# Altium schematic sheet Peripherals.SchDoc: Peripherals
size A4; Date: 01-DEC-2013; CompanyName: STMicroelectronics; Organization: Microcontrollers Division; Address1: 12, Rue Jules HOROWITZ; Address2: 38019 Grenoble; Address3: FRANCE; DocumentNumber: MB1272; Revision: A-01; SheetNumber: 17; SheetTotal: 18; Project: STM32MP15-DISCO PI
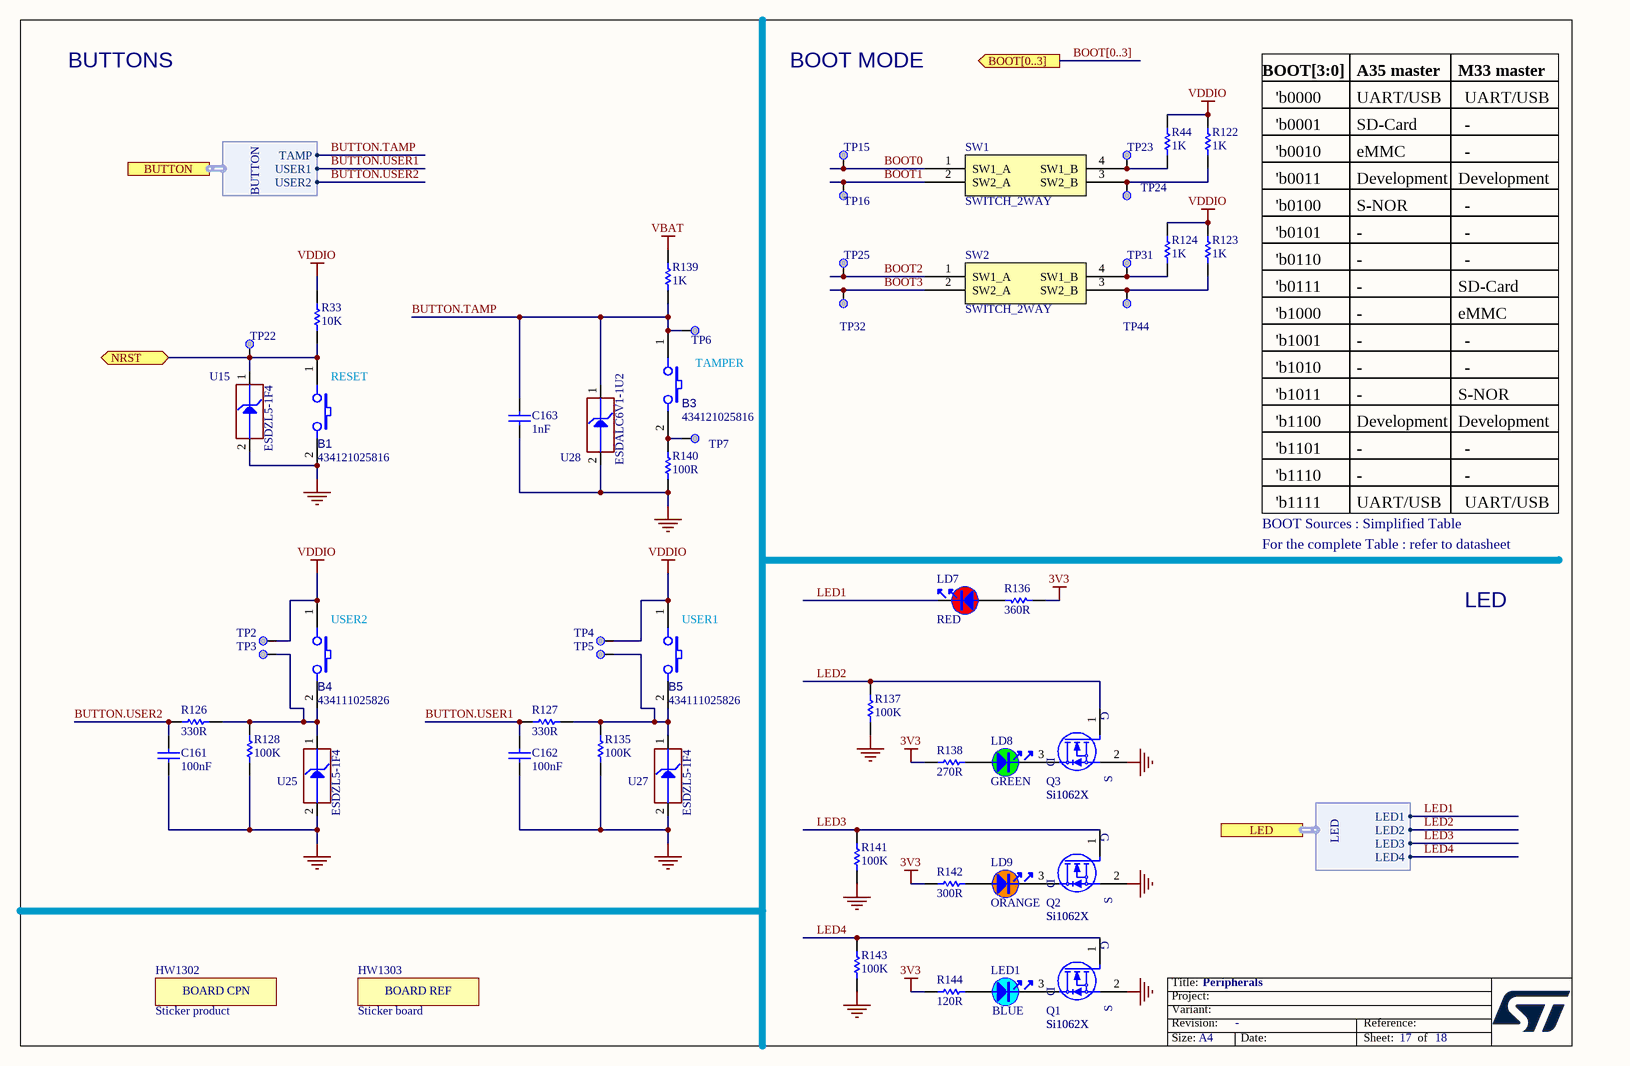
[diagram p0: Peripherals.SchDoc]

## Parts
B1  value 434121025816  [SWI_WE_434121025816]  (hidden comment: SW_PUSH_SMD_2P)
B3  value 434121025816  [SWI_WE_434121025816]  (hidden comment: SW_PUSH_SMD_2P)
B4  value 434111025826  [SWI_WE_4341x10258x6]  (hidden comment: SW_PUSH_SMD_2P)
B5  value 434111025826  [SWI_WE_4341x10258x6]  (hidden comment: SW_PUSH_SMD_2P)
C161  value 100nF  [C0402]  (hidden comment: Capacitor)
C162  value 100nF  [C0402]  (hidden comment: Capacitor)
C163  value 1nF  [C0402]  (hidden comment: Capacitor)
HW1302  value Sticker product  [STICKER_BOARD-CPN_25X5]  (hidden comment: ​PCH W35 footprint requested to have a space on board for stickers.)  (mechanical)
HW1303  value Sticker board  [STICKER_BOARD-REF_25X5]  (hidden comment: STICKER_BOARD_REF)  (mechanical)
LD7  value RED  [LED_0603_VISHAY_VLMS1300-GS08_RED_1A2K_H0P8]  (hidden comment: LED_red)
LD8  value GREEN  [LED_0603_OSRAM_LG-Q396-PS-35_GREEN_1A2K_H0P4]  (hidden comment: LED_green)
LD9  value ORANGE  [LED_0603_OSRAM_LO-Q976-PS-25_ORANGE_1A2K_H0P8]  (hidden comment: LED_orange)
LED1  value BLUE  [LED_0603_OSRAM_LB-Q39G-L2OO-35-1_BLUE_1A2K_H0P4]
Q1  value Si1062X  Manufacturer_Part_Number: Si1062X  [MOS_SC89-3L]  (hidden comment: MOSFET_N-CHANNEL)
Q2  value Si1062X  Manufacturer_Part_Number: Si1062X  [MOS_SC89-3L]  (hidden comment: MOSFET_N-CHANNEL)
Q3  value Si1062X  Manufacturer_Part_Number: Si1062X  [MOS_SC89-3L]  (hidden comment: MOSFET_N-CHANNEL)
R33  value 10K  [R0402]  (hidden comment: Resistor)
R44  value 1K  [R0402]  (hidden comment: Resistor)
R122  value 1K  [R0402]  (hidden comment: Resistor)
R123  value 1K  [R0402]  (hidden comment: Resistor)
R124  value 1K  [R0402]  (hidden comment: Resistor)
R126  value 330R  [R0402]  (hidden comment: Resistor)
R127  value 330R  [R0402]  (hidden comment: Resistor)
R128  value 100K  [R0402]  (hidden comment: Resistor)
R135  value 100K  [R0402]  (hidden comment: Resistor)
R136  value 360R  [R0402]  (hidden comment: Resistor)
R137  value 100K  [R0402]  (hidden comment: Resistor)
R138  value 270R  [R0402]  (hidden comment: Resistor)
R139  value 1K  [R0402]  (hidden comment: Resistor)
R140  value 100R  [R0402]  (hidden comment: Resistor)
R141  value 100K  [R0402]  (hidden comment: Resistor)
R142  value 300R  [R0402]  (hidden comment: Resistor)
R143  value 100K  [R0402]  (hidden comment: Resistor)
R144  value 120R  [R0402]
SW1  SWITCH_2WAY  [SWI_C&K_SDA02H1SBD_2POS]
SW2  SWITCH_2WAY  [SWI_C&K_SDA02H1SBD_2POS]
TP2  Test Point  [TP_SMD_1MM]  (value not drawn)  (no BOM)
TP3  Test Point  [TP_SMD_1MM]  (value not drawn)  (no BOM)
TP4  Test Point  [TP_SMD_1MM]  (value not drawn)  (no BOM)
TP5  Test Point  [TP_SMD_1MM]  (value not drawn)  (no BOM)
TP6  Test Point  [TP_SMD_1MM]  (value not drawn)  (no BOM)
TP7  Test Point  [TP_SMD_1MM]  (value not drawn)  (no BOM)
TP15  Test Point  [TP_SMD_1MM]  (value not drawn)  (no BOM)
TP16  Test Point  [TP_SMD_1MM]  (value not drawn)  (no BOM)
TP22  Test Point  [TP_SMD_1MM]  (value not drawn)  (no BOM)
TP23  Test Point  [TP_SMD_1MM]  (value not drawn)  (no BOM)
TP24  Test Point  [TP_SMD_1MM]  (value not drawn)  (no BOM)
TP25  Test Point  [TP_SMD_1MM]  (value not drawn)  (no BOM)
TP31  Test Point  [TP_SMD_1MM]  (value not drawn)  (no BOM)
TP32  Test Point  [TP_SMD_1MM]  (value not drawn)  (no BOM)
TP44  Test Point  [TP_SMD_1MM]  (value not drawn)  (no BOM)
U15  value ESDZL5-1F4  [ESD_ST0201]  (hidden comment: ESD-TRANSIL)
U25  value ESDZL5-1F4  [ESD_ST0201]  (hidden comment: ESD-TRANSIL)
U27  value ESDZL5-1F4  [ESD_ST0201]  (hidden comment: ESD-TRANSIL)
U28  value ESDALC6V1-1U2  [ESD_ST0201]  (hidden comment: ESD-TRANSIL)

## Ports
BOOT[0..3] (out), BUTTON (harness BUTTON), LED (harness LED), NRST (bidir)

## Harnesses
BUTTON: TAMP, USER1, USER2
LED: LED1, LED2, LED3, LED4

## Nets
3V3: R136.1 R138.2 R142.2 R144.1
GND: B1.2 C161.1 C162.1 C163.1 Q1.2(S) Q2.2(S) Q3.2(S) R128.1 R135.1 R137.1 R140.2 R141.1 R143.1 U15.2(GND) U25.2(GND) U27.2(GND) U28.2(GND)
VBAT: R139.2
VDDIO: B4.1 B5.1 R33.2 R44.2 R122.2 R123.2 R124.2 TP2.1 TP4.1
BOOT0: SW1.1(SW1_A) TP15.1
BOOT1: SW1.2(SW2_A) TP16.1
BOOT2: SW2.1(SW1_A) TP25.1
BOOT3: SW2.2(SW2_A) TP32.1
BUTTON.TAMP: B3.1 C163.2 R139.1 TP6.1 U28.1(IO1) ; port BUTTON.TAMP
BUTTON.USER1: C162.2 R127.1 ; port BUTTON.USER1
BUTTON.USER2: C161.2 R126.1 ; port BUTTON.USER2
LED1: LD7.2 ; port LED.LED1
LED2: Q3.1(G) R137.2 ; port LED.LED2
LED3: Q2.1(G) R141.2 ; port LED.LED3
LED4: Q1.1(G) R143.2 ; port LED.LED4
NRST: B1.1 R33.1 TP22.1 U15.1(IO1) ; port NRST
NetB3_2: B3.2 R140.1 TP7.1
NetB4_2: B4.2 R126.2 R128.2 TP3.1 U25.1(IO1)
NetB5_2: B5.2 R127.2 R135.2 TP5.1 U27.1(IO1)
NetLD7_1: LD7.1 R136.2
NetLD8_1: LD8.1 R138.1
NetLD8_2: LD8.2 Q3.3(D)
NetLD9_1: LD9.1 R142.1
NetLD9_2: LD9.2 Q2.3(D)
NetLED1_1: LED1.1 R144.2
NetLED1_2: LED1.2 Q1.3(D)
NetR44_1: R44.1 SW1.4(SW1_B) TP23.1
NetR122_1: R122.1 SW1.3(SW2_B) TP24.1
NetR123_1: R123.1 SW2.3(SW2_B) TP44.1
NetR124_1: R124.1 SW2.4(SW1_B) TP31.1

## Buses and harness runs
bus BOOT[0..3] = port BOOT[0..3]

## Notes on the sheet
- BUTTONS
- BOOT MODE
- BOOT[3:0]
- 'b0001
- 'b0000
- A35 master
- UART/USB
- SD-Card
- M33 master
- -
- 'b0010
- 'b0011
- eMMC
- Development
- 'b0100
- 'b0101
- 'b0110
- S-NOR
- 'b0111
- 'b1000
- (near B1) RESET
- TAMPER
- 'b1001
- 'b1010
- 'b1011
- 'b1100
- 'b1101
- BOOT Sources : Simplified Table
- 'b1110
- 'b1111
- For the complete Table : refer to datasheet
- (near B4) USER2
- (near B5) USER1
- LED
- Title:
- Project:
- Size:
- Revision:
- Variant:
- A4
- Date:
- Reference:
- Sheet:
- of
- (in symbol MCD-00235) BOARD REF
- (in symbol MCD-00547) BOARD CPN

## Library data of the parts
B1 B3 = MCD-03492: Switch tactile, SPST-NO, 50mA, 12V, 6x3.8mm; Part_Type: Misc; Part_Preference: Recommended; Manufacturer: WURTH ELEKTRONIC; ShowFields: YES; ID: 5608; Component_Country_Of_Origin: China°; Internal_Part_Number: MCD-03492; Status: Checked; Manufacturer_Part_Number: 434121025816; ComponentLink1URL: http://tunmcdsvn.tun.st.com/Component_Documentation_Library/Trunk/Misc/WURTH_ELECTRONIK_434121025816; Order_Code_Digikey: 732-7045-2-ND; Order_Code_Farnell: 1867991; Order_Code_RS: N/A; Package: 6x3.8mm
B4 B5 = MCD-03491: Switch tactile, SPST-NO, 50mA, 12V, 6x3.8mm; Part_Type: Misc; Part_Preference: Recommended; Manufacturer: WURTH ELEKTRONIC; ShowFields: YES; ID: 5607; Component_Country_Of_Origin: China°; Internal_Part_Number: MCD-03491; Status: Checked; Manufacturer_Part_Number: 434111025826; ComponentLink1URL: http://tunmcdsvn.tun.st.com/Component_Documentation_Library/Trunk/Misc/WURTH_ELECTRONIK_434111025826; Order_Code_Digikey: 732-7039-2-ND; Order_Code_Farnell: 1867992; Order_Code_RS: N/A; Package: 6x3.8mm
C161 C162 = MCD-00006: Capacitor, MLCC, 100nF, 16V, X7R, +/-10%, 0402, T=0.5mm; Manufacturer_Part_Number: CC0402KRX7R7BB104; Manufacturer: YAGEO; Part_Preference: Recommended; Alternate_Manufacturer: MURATA; Alternate_Manufacturer_Part_Number: GCM155R71C104KA55D; Partial_Alternate_Internal_Part_Number: MCD-03299; Order_Code_RS: 616-9701; Component_Country_Of_Origin: China; ID: 2474; ShowFields: YES; Alternate_EMS: M; Internal_Part_Number: MCD-00006; Status: Released; Part_Type: Capacitor; Package: 0402; ComponentLink1Description: Datasheet; ComponentLink1URL: http://tunmcdsvn.tun.st.com/Component_Documentation_Library/Trunk/Capacitor/YAGEO_X7R_Series; Order_Code_Digikey: 311-1338-1-ND; Order_Code_Farnell: 9402047
C163 = MCD-00198: Capacitor, MLCC, 1nF, 16V, X7R, +/-10%, 0402, T=0.5mm; Part_Preference: Recommended; Manufacturer: YAGEO; Manufacturer_Part_Number: CC0402KRX7R7BB102; Component_Country_Of_Origin: China; ShowFields: YES; ID: 2665; Internal_Part_Number: MCD-00198; Status: Released; Part_Type: Capacitor; Package: 0402; ComponentLink1URL: http://tunmcdsvn.tun.st.com/Component_Documentation_Library/Trunk/Capacitor/YAGEO_X7R_Series; Order_Code_Digikey: 311-1352-1-ND; Order_Code_Farnell: 2370642; Order_Code_RS: N/A
HW1302 = MCD-00547: Sticker to mention board CPN code; Part_Type: Misc; Part_Preference: Recommended; Provided_By: SUBCO; Initial_Board_Reference: MB1319; ID: 3197; ShowFields: YES; Internal_Part_Number: MCD-00547; Status: Released; Manufacturer_Part_Number: n/a; Manufacturer: n/a; ComponentLink1Description: Datasheet; ComponentLink1URL: N/A; ECCN_US: n/a; ECCN_EU: n/a; Order_Code_Digikey: N/A; Order_Code_Farnell: N/A; Order_Code_RS: N/A
HW1303 = MCD-00235: Sticker to mention board reference + serial number; Part_Type: Misc; Part_Preference: Recommended; Provided_By: SUBCO; Initial_Board_Reference: MB1319; ID: 2632; ShowFields: YES; Internal_Part_Number: MCD-00235; Status: Released; Manufacturer_Part_Number: n/a; Manufacturer: n/a; ComponentLink1Description: Datasheet; ComponentLink1URL: n/a; ECCN_US: n/a; ECCN_EU: n/a; Order_Code_Digikey: N/A; Order_Code_Farnell: N/A; Order_Code_RS: N/A
LD7 = MCD-00587: LED Red, 0603 SMD, 2V Forward Voltage; Part_Type: Display; Manufacturer_Part_Number: VLMS1300-GS08; Manufacturer: VISHAY; Alternate_Manufacturer_Part_Number: LS Q976-NR-1; Alternate_Manufacturer: OSRAM OPTO SEMICONDUCTORS; Alternate_Internal_Part_Number: MCD-02401; Part_Preference: Recommended; Provided_By: SUBCO; Component_Country_Of_Origin: China; ID: 3154; ShowFields: YES; Internal_Part_Number: MCD-00587; Status: Released; Package: LED 0603; ComponentLink1Description: Datasheet; ComponentLink1URL: http://tunmcdsvn.tun.st.com/Component_Documentation_Library/Trunk/Display/VISHAY_VLMx1300-GS08_Series; Order_Code_Digikey: VLMS1300-GS08CT-ND; Order_Code_Farnell: 2078728; ECCN_US: n/a; ECCN_EU: n/a; Order_Code_RS: N/A; Full_Alternate_Internal_Part_Number: MCD-02401
LD8 = MCD-00588: LED Green, 0603 SMD, Forward Voltage Typ=2V, Max=2.5V; Part_Type: Display; Manufacturer_Part_Number: LG Q396-PS-35; Manufacturer: OSRAM OPTO SEMICONDUCTORS; Alternate_Manufacturer_Part_Number: VLMTG1300-GS08; Alternate_Manufacturer: VISHAY SEMICONDUCTOR OPTO DIVISION; Alternate_Internal_Part_Number: MCD-02400; Part_Preference: Recommended; Provided_By: SUBCO; Component_Country_Of_Origin: Unknown; ID: 3155; ShowFields: YES; Internal_Part_Number: MCD-00588; Status: Released; Package: LED 0603; ComponentLink1Description: Datasheet; ComponentLink1URL: http://tunmcdsvn.tun.st.com/Component_Documentation_Library/Trunk/Display/OSRAM_OPTO_SEMICONDUCTORS_LG-Q396-PS-35; Order_Code_Digikey: LG Q396-PS-35-ND; ECCN_US: n/a; ECCN_EU: n/a; Order_Code_Farnell: N/A; Order_Code_RS: N/A; Full_Alternate_Internal_Part_Number: MCD-02400
LD9 = MCD-00590: LED Orange, 0603 SMD, Forward Voltage Min=1.6V, Max=2.4V; Part_Type: Display; Manufacturer_Part_Number: LO Q976-PS-25; Manufacturer: OSRAM OPTO SEMICONDUCTORS; Alternate_Manufacturer_Part_Number: VLMO1300-GS08; Alternate_Manufacturer: VISHAY SEMICONDUCTOR OPTO DIVISION; Part_Preference: Recommended; Provided_By: SUBCO; Component_Country_Of_Origin: Unknown; ID: 3156; ShowFields: YES; Internal_Part_Number: MCD-00590; Status: Released; Package: LED 0603; ComponentLink1Description: Datasheet; ComponentLink1URL: http://tunmcdsvn.tun.st.com/Component_Documentation_Library/Trunk/Display/OSRAM_OPTO_SEMICONDUCTORS_LO-Q976-PS-25; ECCN_US: n/a; ECCN_EU: n/a; Order_Code_Digikey: N/A; Order_Code_Farnell: N/A; Order_Code_RS: N/A
LED1 = MCD-00585: LED Blue, 0603 SMD, Forward Voltage Min=2,8V, Max=3,8V; Part_Type: Display; Manufacturer_Part_Number: LB Q39G-L2OO-35-1; Manufacturer: OSRAM OPTO SEMICONDUCTORS; Alternate_Manufacturer_Part_Number: 19-217-BHC-ZL1M2RY-3T-V4; Alternate_Manufacturer: EVERLIGHT; Alternate_Internal_Part_Number: MCD-02398; Part_Preference: Recommended; Order_Code_RS: 9148643; Provided_By: SUBCO; Component_Country_Of_Origin: Unknown; ID: 3159; ShowFields: YES; Internal_Part_Number: MCD-00585; Status: Released; Package: LED 0603; ComponentLink1Description: Datasheet; ComponentLink1URL: http://tunmcdsvn.tun.st.com/Component_Documentation_Library/Trunk/Display/OSRAM_OPTO_SEMICONDUCTORS_LB-Q39G_Series; Order_Code_Digikey: 475-2816-1-ND; ECCN_US: n/a; ECCN_EU: n/a; Order_Code_Farnell: N/A; Full_Alternate_Internal_Part_Number: MCD-02398
Q1-Q3 = MCD-02221: MOSFET N-CH 20V SC-89; Part_Preference: Recommended; Part_Type: Transistor; Manufacturer: VISHAY; Order_Code_RS: 812-3044; Component_Country_Of_Origin: Philippines; ID: 4321; ShowFields: YES; Internal_Part_Number: MCD-02221; Status: Checked; Package: SC-89; ComponentLink1Description: Part_Information; ComponentLink1URL: http://tunmcdsvn.tun.st.com/Component_Documentation_Library/Trunk/Transistor/VISHAY_SI1062X; Alternate_Manufacturer: N/A; Alternate_Manufacturer_Part_Number: N/A; Order_Code_Digikey: SI1062X-T1-GE3CT-ND; Order_Code_Farnell: 2646363
R33 = MCD-00053: Resistor,10K,0402,1%,1/16W; Manufacturer_Part_Number: RC0402FR-0710KL; Manufacturer: YAGEO; BMS_Part_Number: 9131590; Part_Preference: Recommended; Component_Country_Of_Origin: China; ID: 2539; ShowFields: YES; Internal_Part_Number: MCD-00053; ComponentLink1Description: Datasheet; Status: Released; Part_Type: Resistor; ComponentLink1URL: http://tunmcdsvn.tun.st.com/Component_Documentation_Library/Trunk/Resistor/YAGEO_RC_L_Series; Package: 0402; Order_Code_Digikey: 311-10.0KLRCT-ND; Order_Code_Farnell: 9239359; Order_Code_RS: N/A; Alternate_Manufacturer: N/A; Alternate_Manufacturer_Part_Number: N/A
R44 R122-R124 = MCD-00061: Resistor,1K,0402,1%,1/16W; Part_Preference: Recommended; Manufacturer: YAGEO; Manufacturer_Part_Number: RC0402FR-071KL; Component_Country_Of_Origin: China; ID: 2532; ShowFields: YES; Internal_Part_Number: MCD-00061; Status: Released; Part_Type: Resistor; Package: 0402; ComponentLink1Description: Datasheet; ComponentLink1URL: http://tunmcdsvn.tun.st.com/Component_Documentation_Library/Trunk/Resistor/YAGEO_RC_L_Series; Order_Code_Digikey: 311-1.00KLRCT-ND; Order_Code_Farnell: 9239235; Order_Code_RS: N/A; Alternate_Manufacturer: N/A; Alternate_Manufacturer_Part_Number: N/A
R126 R127 = MCD-00062: Resistor,330R,0402,1%,1/16W; Manufacturer_Part_Number: RC0402FR-07330RL; Manufacturer: YAGEO; Part_Preference: Recommended; Component_Country_Of_Origin: China; ID: 2529; ShowFields: YES; Internal_Part_Number: MCD-00062; Status: Released; Part_Type: Resistor; Package: 0402; ComponentLink1Description: Datasheet; ComponentLink1URL: http://tunmcdsvn.tun.st.com/Component_Documentation_Library/Trunk/Resistor/YAGEO_RC_L_Series; Order_Code_Digikey: 311-330LRCT-ND; Order_Code_Farnell: 9239170; Order_Code_RS: N/A; Alternate_Manufacturer: N/A; Alternate_Manufacturer_Part_Number: N/A
R128 R135 R137 R141 R143 = MCD-00059: Resistor,100K,0402,1%,1/16W; Manufacturer_Part_Number: RC0402FR-07100KL; Manufacturer: YAGEO; Alternate_Manufacturer_Part_Number: RT0402FRE07100KL; Part_Preference: Recommended; Partial_Alternate_Internal_Part_Number: MCD-03301; Component_Country_Of_Origin: China; ID: 2533; ShowFields: YES; Alternate_EMS: M; Internal_Part_Number: MCD-00059; Status: Released; Part_Type: Resistor; Alternate_Manufacturer: YAGEO; Package: 0402; ComponentLink1Description: Datasheet; ComponentLink1URL: http://tunmcdsvn.tun.st.com/Component_Documentation_Library/Trunk/Resistor/YAGEO_RC_L_Series; Order_Code_Digikey: 311-100KLRTR-ND; Order_Code_Farnell: 2421891; Order_Code_RS: N/A
R136 = MCD-00461: Resistor,360R,0402,1%,1/16W; Manufacturer_Part_Number: RC0402FR-07360RL; Manufacturer: YAGEO; Part_Preference: Recommended; Provided_By: SUBCO; ECCN_US: EAR99; ECCN_EU: NEC; Component_Country_Of_Origin: China; ID: 2816; ShowFields: YES; Internal_Part_Number: MCD-00461; Status: Released; Part_Type: Resistor; Package: 0402; ComponentLink1Description: Datasheet; ComponentLink1URL: http://tunmcdsvn.tun.st.com/Component_Documentation_Library/Trunk/Resistor/YAGEO_RC_L_Series; Order_Code_Digikey: YAG3132CT-ND; Order_Code_Farnell: 1458786; Order_Code_RS: N/A
R138 = MCD-00441: Resistor,270R,0402,1%,1/16W; Manufacturer_Part_Number: RC0402FR-07270RL; Manufacturer: YAGEO; Part_Preference: Recommended; Provided_By: SUBCO; ECCN_US: EAR99; ECCN_EU: NEC; Component_Country_Of_Origin: China; ID: 2838; ShowFields: YES; Internal_Part_Number: MCD-00441; Status: Released; Part_Type: Resistor; Package: 0402; ComponentLink1Description: Datasheet; ComponentLink1URL: http://tunmcdsvn.tun.st.com/Component_Documentation_Library/Trunk/Resistor/YAGEO_RC_L_Series; Order_Code_Digikey: 311-270LRCT-ND; Order_Code_Farnell: 9239162; Order_Code_RS: N/A
R139 = MCD-00061: Resistor, 1K, 0402, +/-1%,1/16W; Manufacturer_Part_Number: RC0402FR-071KL; Manufacturer: YAGEO; Part_Preference: Recommended; Component_Country_Of_Origin: China; ShowFields: YES; ID: 2532; Internal_Part_Number: MCD-00061; Status: Released; Part_Type: Resistor; ComponentLink1URL: http://tunmcdsvn.tun.st.com/Component_Documentation_Library/Trunk/Resistor/YAGEO_RC_L_Series; Package: 0402; Order_Code_Digikey: 311-1.00KLRCT-ND; Order_Code_Farnell: 9239235; Order_Code_RS: N/A
R140 = MCD-00067: Resistor, 100R, 0402, +/- 1%, 1/16W; Manufacturer_Part_Number: RC0402FR-07100RL; Manufacturer: YAGEO; Part_Preference: Recommended; Component_Country_Of_Origin: China; ShowFields: YES; ID: 2527; Internal_Part_Number: MCD-00067; Status: Released; Part_Type: Resistor; ComponentLink1URL: http://tunmcdsvn.tun.st.com/Component_Documentation_Library/Trunk/Resistor/YAGEO_RC_L_Series; Package: 0402; Order_Code_Digikey: 311-100LRCT-ND; Order_Code_Farnell: 9239111; Order_Code_RS: N/A
R142 = MCD-00449: Resistor,300R,0402,1%,1/16W; Manufacturer_Part_Number: RC0402FR-07300RL; Manufacturer: YAGEO; Part_Preference: Recommended; Provided_By: SUBCO; ECCN_US: EAR99; ECCN_EU: NEC; Component_Country_Of_Origin: China; ID: 2832; ShowFields: YES; Internal_Part_Number: MCD-00449; Status: Released; Part_Type: Resistor; Package: 0402; ComponentLink1Description: Datasheet; ComponentLink1URL: http://tunmcdsvn.tun.st.com/Component_Documentation_Library/Trunk/Resistor/YAGEO_RC_L_Series; Order_Code_Digikey: 311-300LRCT-ND; Order_Code_Farnell: 1458776; Order_Code_RS: N/A
R144 = MCD-00194: Resistor,120R,0402,1%,1/16W; Manufacturer_Part_Number: RC0402FR-07120RL; Manufacturer: YAGEO; Part_Preference: Recommended; Provided_By: SUBCO; ECCN_US: EAR99; ECCN_EU: NEC; Component_Country_Of_Origin: China; ID: 2674; ShowFields: YES; Internal_Part_Number: MCD-00194; Status: Released; Part_Type: Resistor; Package: 0402; ComponentLink1Description: Datasheet; ComponentLink1URL: http://tunmcdsvn.tun.st.com/Component_Documentation_Library/Trunk/Resistor/YAGEO_RC_L_Series; Order_Code_Digikey: 311-120LRCT-ND; Order_Code_Farnell: 9239120; Order_Code_RS: N/A
SW1 SW2 = MCD-00658: Dip Switch ,2Position ,Surface Mount Slide (Standard) ,2.54 pitch,25mA 24VDC; Part_Type: Misc; Part_Preference: Recommended; Manufacturer: C&K; Manufacturer_Part_Number: SDA02H1SBD; Component_Country_Of_Origin: Malaysia; ShowFields: YES; ID: 3090; Internal_Part_Number: MCD-00658; Value: SWITCH_2WAY; Status: Released; Package: DIP; ComponentLink1URL: http://tunmcdsvn.tun.st.com/Component_Documentation_Library/Trunk/Misc/C&K_SDA02H1SBD; Order_Code_Digikey: N/A; Order_Code_Farnell: N/A; Order_Code_RS: N/A
TP2-TP7 TP15 TP16 TP22-TP25 TP31 TP32 TP44 = MCD-00074: Test Point 1mm; Part_Type: Misc; Part_Preference: Recommended; Initial_Board_Reference: MB1274; ID: 2518; ShowFields: YES; Internal_Part_Number: MCD-00074; Status: Released; Manufacturer_Part_Number: n/a; Manufacturer: n/a; ComponentLink1Description: Datasheet; ComponentLink1URL: http://na; ECCN_US: n/a; ECCN_EU: n/a; Provided_By: n/a; Order_Code_Digikey: N/A; Order_Code_Farnell: N/A; Order_Code_RS: N/A
U15 U25 = MCD-03501: ESD protection , 0201; Part_Type: IC; Manufacturer: STMICROELECTRONICS; Part_Preference: Recommended; Order_Code_RS: 163-7318; ID: 5617; ShowFields: YES; Internal_Part_Number: MCD-03501; Status: New; Manufacturer_Part_Number: ESDZL5-1F4; ComponentLink1URL: http://tunmcdsvn.tun.st.com/Component_Documentation_Library/Trunk/IC/STMICROELECTRONICS_ESDZL5-1F4; Order_Code_Digikey: 497-17544-2-ND; Order_Code_Farnell: ESDZL5-1F4; Package: 0201; Full_Alternate_Internal_Part_Number: N/A
U27 = MCD-03501: ESD protection , 0201; Part_Type: IC; Part_Preference: Recommended; Manufacturer: STMICROELECTRONICS; Order_Code_RS: 163-7318; ShowFields: YES; ID: 5617; Internal_Part_Number: MCD-03501; Status: New; Manufacturer_Part_Number: ESDZL5-1F4; Package: 0201; ComponentLink1URL: http://tunmcdsvn.tun.st.com/Component_Documentation_Library/Trunk/IC/STMICROELECTRONICS_ESDZL5-1F4; Order_Code_Digikey: 497-17544-2-ND; Order_Code_Farnell: ESDZL5-1F4; Full_Alternate_Internal_Part_Number: N/A
U28 = MCD-00170: ESD protection 6V1; Part_Type: Diode; Manufacturer: STMICROELECTRONICS; BMS_Part_Number: 9151132; Part_Preference: Recommended; Manufacturer_HQ_COO: EU; Component_Country_Of_Origin: China; ID: 2696; ShowFields: YES; Internal_Part_Number: MCD-00170; Status: Released; Manufacturer_Part_Number: ESDALC6V1-1U2; ComponentLink1Description: Datasheet; ComponentLink1URL: http://tunmcdsvn.tun.st.com/Component_Datasheet_Library/Trunk/Diodes/STM_ESD_ESDALC6V1-1U2